# EAGLE design LED Cube PCB Board V.6 (EAGLE 8.6.0)
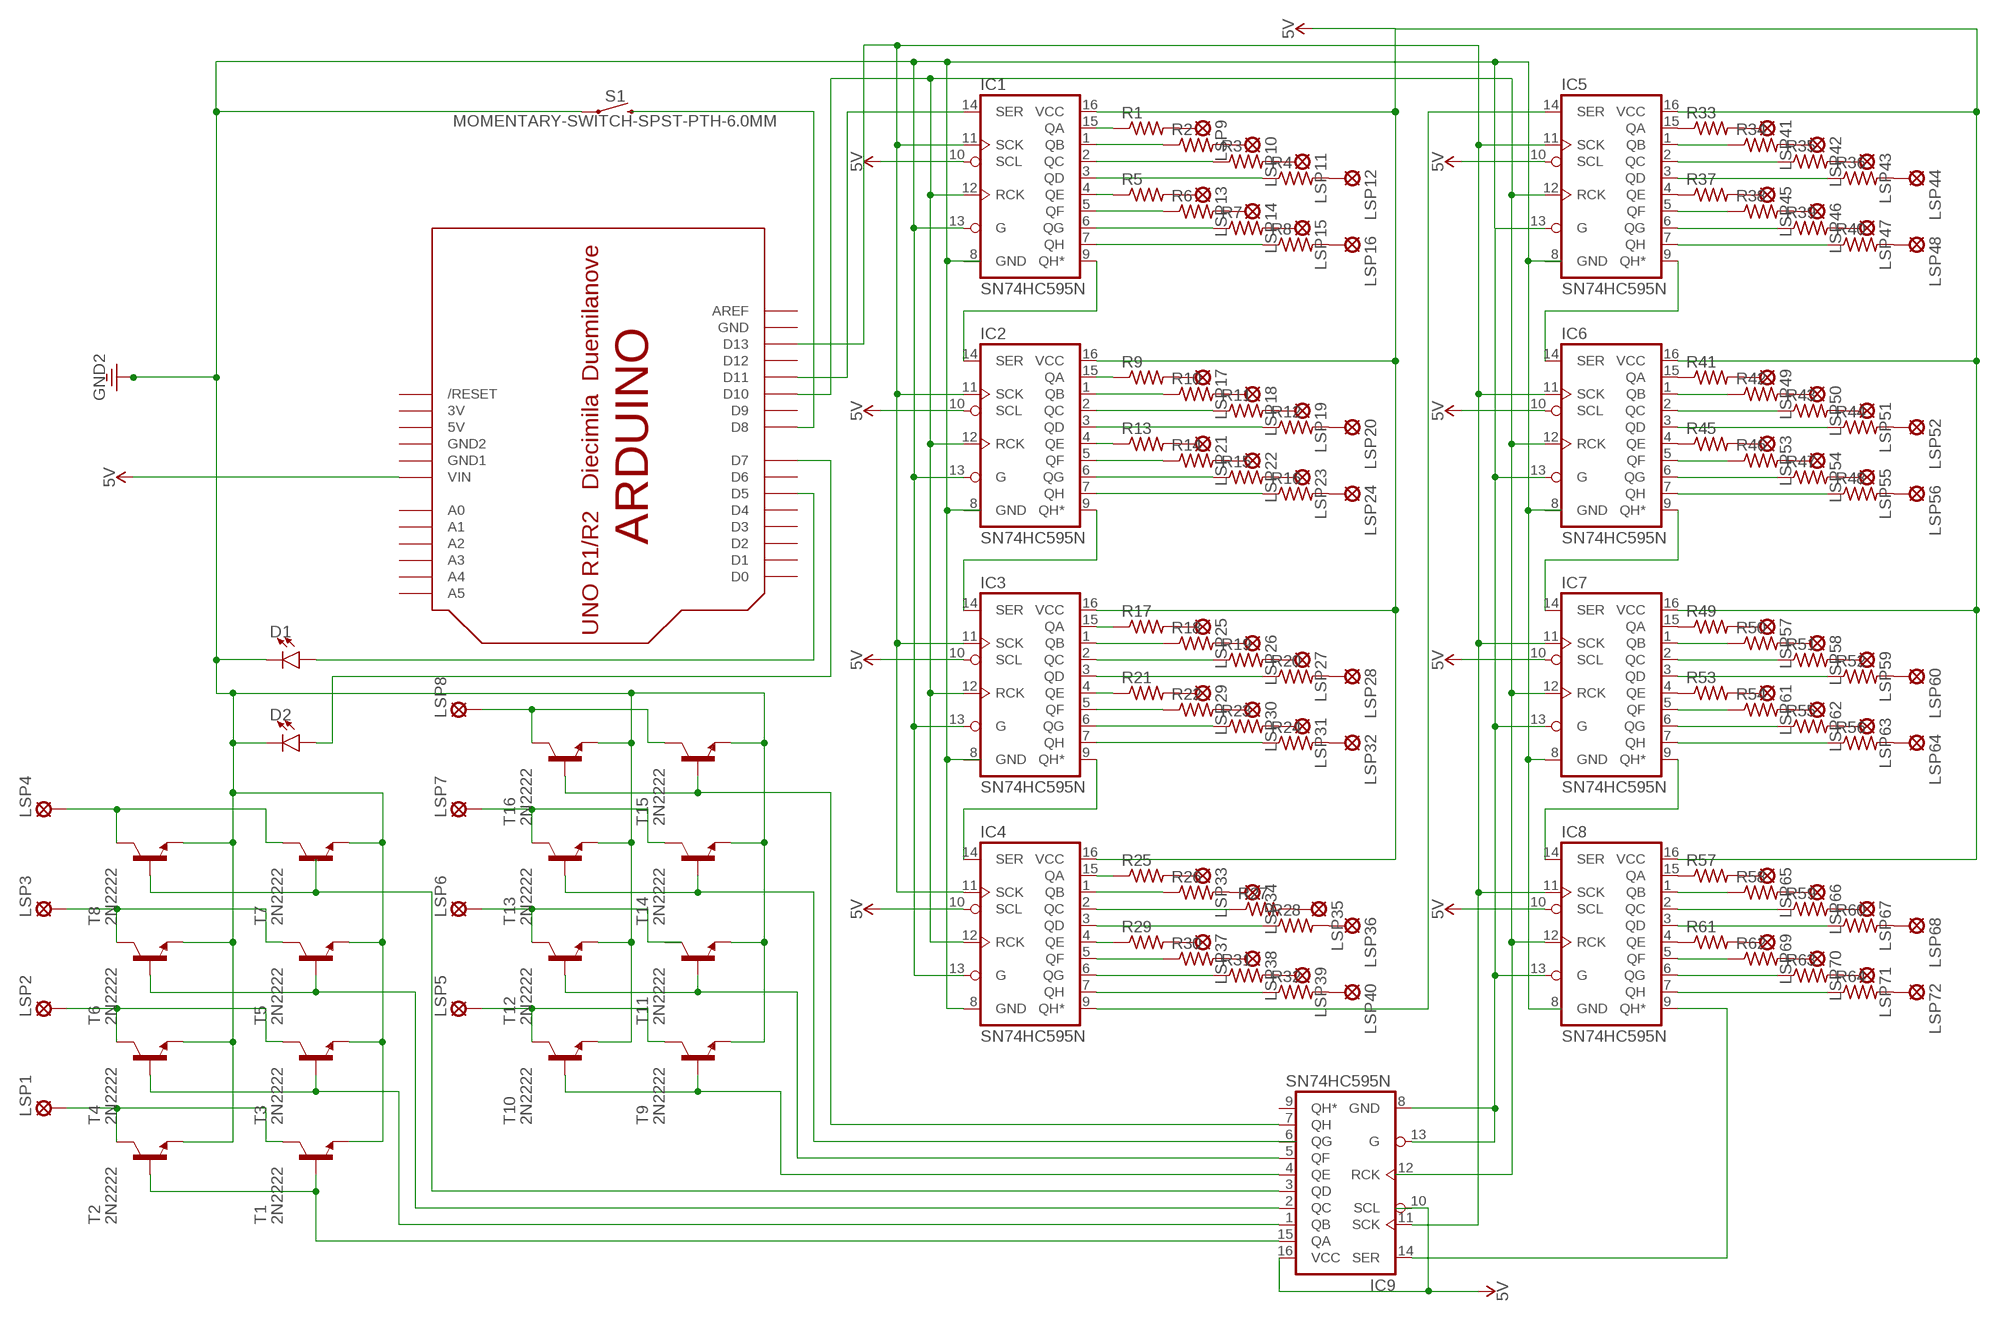
[diagram p0: schematic, sheet 1]

## Parts
D1  LED-3MM-NO_SILK  [LED_3MM-NS]
D2  LED-3MM-NO_SILK  [LED_3MM-NS]
IC1  SN74HC595N  74HC595N  [DIP16]
IC2  SN74HC595N  74HC595N  [DIP16]
IC3  SN74HC595N  74HC595N  [DIP16]
IC4  SN74HC595N  74HC595N  [DIP16]
IC5  SN74HC595N  74HC595N  [DIP16]
IC6  SN74HC595N  74HC595N  [DIP16]
IC7  SN74HC595N  74HC595N  [DIP16]
IC8  SN74HC595N  74HC595N  [DIP16]
IC9  SN74HC595N  74HC595N  [DIP16]
LSP1  LSP10  [LSP10]
LSP2  LSP10  [LSP10]
LSP3  LSP10  [LSP10]
LSP4  LSP10  [LSP10]
LSP5  LSP10  [LSP10]
LSP6  LSP10  [LSP10]
LSP7  LSP10  [LSP10]
LSP8  LSP10  [LSP10]
LSP9  LSP11  [LSP11]
LSP10  LSP11  [LSP11]
LSP11  LSP11  [LSP11]
LSP12  LSP11  [LSP11]
LSP13  LSP11  [LSP11]
LSP14  LSP11  [LSP11]
LSP15  LSP11  [LSP11]
LSP16  LSP11  [LSP11]
LSP17  LSP11  [LSP11]
LSP18  LSP11  [LSP11]
LSP19  LSP11  [LSP11]
LSP20  LSP11  [LSP11]
LSP21  LSP11  [LSP11]
LSP22  LSP11  [LSP11]
LSP23  LSP11  [LSP11]
LSP24  LSP11  [LSP11]
LSP25  LSP11  [LSP11]
LSP26  LSP11  [LSP11]
LSP27  LSP11  [LSP11]
LSP28  LSP11  [LSP11]
LSP29  LSP11  [LSP11]
LSP30  LSP11  [LSP11]
LSP31  LSP11  [LSP11]
LSP32  LSP11  [LSP11]
LSP33  LSP11  [LSP11]
LSP34  LSP11  [LSP11]
LSP35  LSP11  [LSP11]
LSP36  LSP11  [LSP11]
LSP37  LSP11  [LSP11]
LSP38  LSP11  [LSP11]
LSP39  LSP11  [LSP11]
LSP40  LSP11  [LSP11]
LSP41  LSP11  [LSP11]
LSP42  LSP11  [LSP11]
LSP43  LSP11  [LSP11]
LSP44  LSP11  [LSP11]
LSP45  LSP11  [LSP11]
LSP46  LSP11  [LSP11]
LSP47  LSP11  [LSP11]
LSP48  LSP11  [LSP11]
LSP49  LSP11  [LSP11]
LSP50  LSP11  [LSP11]
LSP51  LSP11  [LSP11]
LSP52  LSP11  [LSP11]
LSP53  LSP11  [LSP11]
LSP54  LSP11  [LSP11]
LSP55  LSP11  [LSP11]
LSP56  LSP11  [LSP11]
LSP57  LSP11  [LSP11]
LSP58  LSP11  [LSP11]
LSP59  LSP11  [LSP11]
LSP60  LSP11  [LSP11]
LSP61  LSP11  [LSP11]
LSP62  LSP11  [LSP11]
LSP63  LSP11  [LSP11]
LSP64  LSP11  [LSP11]
LSP65  LSP11  [LSP11]
LSP66  LSP11  [LSP11]
LSP67  LSP11  [LSP11]
LSP68  LSP11  [LSP11]
LSP69  LSP11  [LSP11]
LSP70  LSP11  [LSP11]
LSP71  LSP11  [LSP11]
LSP72  LSP11  [LSP11]
R1  R-US_0204/5  [0204/5]
R2  R-US_0204/5  [0204/5]
R3  R-US_0204/5  [0204/5]
R4  R-US_0204/5  [0204/5]
R5  R-US_0204/5  [0204/5]
R6  R-US_0204/5  [0204/5]
R7  R-US_0204/5  [0204/5]
R8  R-US_0204/5  [0204/5]
R9  R-US_0204/5  [0204/5]
R10  R-US_0204/5  [0204/5]
R11  R-US_0204/5  [0204/5]
R12  R-US_0204/5  [0204/5]
R13  R-US_0204/5  [0204/5]
R14  R-US_0204/5  [0204/5]
R15  R-US_0204/5  [0204/5]
R16  R-US_0204/5  [0204/5]
R17  R-US_0204/5  [0204/5]
R18  R-US_0204/5  [0204/5]
R19  R-US_0204/5  [0204/5]
R20  R-US_0204/5  [0204/5]
R21  R-US_0204/5  [0204/5]
R22  R-US_0204/5  [0204/5]
R23  R-US_0204/5  [0204/5]
R24  R-US_0204/5  [0204/5]
R25  R-US_0204/5  [0204/5]
R26  R-US_0204/5  [0204/5]
R27  R-US_0204/5  [0204/5]
R28  R-US_0204/5  [0204/5]
R29  R-US_0204/5  [0204/5]
R30  R-US_0204/5  [0204/5]
R31  R-US_0204/5  [0204/5]
R32  R-US_0204/5  [0204/5]
R33  R-US_0204/5  [0204/5]
R34  R-US_0204/5  [0204/5]
R35  R-US_0204/5  [0204/5]
R36  R-US_0204/5  [0204/5]
R37  R-US_0204/5  [0204/5]
R38  R-US_0204/5  [0204/5]
R39  R-US_0204/5  [0204/5]
R40  R-US_0204/5  [0204/5]
R41  R-US_0204/5  [0204/5]
R42  R-US_0204/5  [0204/5]
R43  R-US_0204/5  [0204/5]
R44  R-US_0204/5  [0204/5]
R45  R-US_0204/5  [0204/5]
R46  R-US_0204/5  [0204/5]
R47  R-US_0204/5  [0204/5]
R48  R-US_0204/5  [0204/5]
R49  R-US_0204/5  [0204/5]
R50  R-US_0204/5  [0204/5]
R51  R-US_0204/5  [0204/5]
R52  R-US_0204/5  [0204/5]
R53  R-US_0204/5  [0204/5]
R54  R-US_0204/5  [0204/5]
R55  R-US_0204/5  [0204/5]
R56  R-US_0204/5  [0204/5]
R57  R-US_0204/5  [0204/5]
R58  R-US_0204/5  [0204/5]
R59  R-US_0204/5  [0204/5]
R60  R-US_0204/5  [0204/5]
R61  R-US_0204/5  [0204/5]
R62  R-US_0204/5  [0204/5]
R63  R-US_0204/5  [0204/5]
R64  R-US_0204/5  [0204/5]
S1  MOMENTARY-SWITCH-SPST-PTH-6.0MM  [TACTILE_SWITCH_PTH_6.0MM]
T1  2N2222  [TO92-EBC-OVAL]
T2  2N2222  [TO92-EBC-OVAL]
T3  2N2222  [TO92-EBC-OVAL]
T4  2N2222  [TO92-EBC-OVAL]
T5  2N2222  [TO92-EBC-OVAL]
T6  2N2222  [TO92-EBC-OVAL]
T7  2N2222  [TO92-EBC-OVAL]
T8  2N2222  [TO92-EBC-OVAL]
T9  2N2222  [TO92-EBC-OVAL]
T10  2N2222  [TO92-EBC-OVAL]
T11  2N2222  [TO92-EBC-OVAL]
T12  2N2222  [TO92-EBC-OVAL]
T13  2N2222  [TO92-EBC-OVAL]
T14  2N2222  [TO92-EBC-OVAL]
T15  2N2222  [TO92-EBC-OVAL]
T16  2N2222  [TO92-EBC-OVAL]
U$1  ARDUINO-NOHOLE  [ARDUINO-NOHOLE]

## Nets
5V: IC1.10(SCL) IC1.16(VCC) IC2.16(VCC) IC3.16(VCC) IC4.16(VCC) IC5.10(SCL) IC5.16(VCC) IC6.10(SCL) IC6.16(VCC) IC7.10(SCL) IC7.16(VCC) IC8.10(SCL) IC8.16(VCC) IC9.10(SCL) IC9.16(VCC) U$1.VIN
GND: D1.K(C) D2.K(C) IC1.13(G) IC2.13(G) IC3.13(G) IC4.8(GND) IC4.13(G) IC5.8(GND) IC5.13(G) IC6.8(GND) IC6.13(G) IC7.8(GND) IC7.13(G) IC8.8(GND) IC8.13(G) IC9.8(GND) IC9.13(G) S1.1 T1.E T2.E T3.E T4.E T5.E T6.E T7.E T8.E T9.E T10.E T11.E T12.E T13.E T14.E T15.E T16.E ; supply symbol labelled GND2
N$1: IC1.7(QH) R8.1
N$2: IC1.6(QG) R7.1
N$3: IC1.5(QF) R6.1
N$4: IC1.4(QE) R5.1
N$5: IC1.3(QD) R4.1
N$6: IC1.2(QC) R3.1
N$7: IC1.1(QB) R2.1
N$8: IC1.15(QA) R1.1
N$9: LSP9.MP R1.2
N$10: LSP10.MP R2.2
N$11: LSP11.MP R3.2
N$12: LSP12.MP R4.2
N$13: LSP13.MP R5.2
N$14: LSP14.MP R6.2
N$15: LSP15.MP R7.2
N$16: LSP16.MP R8.2
N$17: IC6.1(QB) R42.1
N$18: IC6.2(QC) R43.1
N$19: IC6.3(QD) R44.1
N$20: IC6.5(QF) R46.1
N$21: IC6.6(QG) R47.1
N$22: IC6.7(QH) R48.1
N$23: IC8.1(QB) R58.1
N$24: IC8.2(QC) R59.1
N$25: IC8.3(QD) R60.1
N$26: IC8.5(QF) R62.1
N$27: IC8.6(QG) R63.1
N$28: IC8.7(QH) R64.1
N$29: IC9.7(QH) T15.B T16.B
N$30: T13.B T14.B
N$31: IC9.5(QF) T11.B T12.B
N$32: IC9.4(QE) T9.B T10.B
N$33: IC2.7(QH) R16.1
N$34: IC2.6(QG) R15.1
N$35: IC2.5(QF) R14.1
N$36: IC2.4(QE) R13.1
N$37: IC2.3(QD) R12.1
N$38: IC2.2(QC) R11.1
N$39: IC2.1(QB) R10.1
N$40: IC2.15(QA) R9.1
N$41: IC5.15(QA) R33.1
N$42: IC5.4(QE) R37.1
N$43: IC6.15(QA) R41.1
N$44: IC6.4(QE) R45.1
N$45: IC8.15(QA) R57.1
N$46: IC8.4(QE) R61.1
N$47: IC7.4(QE) R53.1
N$48: IC7.15(QA) R49.1
N$49: IC4.1(QB) R26.1
N$50: IC4.15(QA) R25.1
N$51: LSP17.MP R9.2
N$52: IC4.2(QC) R27.1
N$53: LSP18.MP R10.2
N$54: IC4.3(QD) R28.1
N$55: IC4.4(QE) R29.1
N$56: IC4.5(QF) R30.1
N$57: IC3.1(QB) R18.1
N$58: IC4.6(QG) R31.1
N$59: IC4.7(QH) R32.1
N$60: LSP19.MP R11.2
N$61: LSP20.MP R12.2
N$62: LSP21.MP R13.2
N$63: LSP22.MP R14.2
N$64: LSP23.MP R15.2
N$65: IC3.7(QH) R24.1
N$66: IC3.6(QG) R23.1
N$67: IC3.5(QF) R22.1
N$68: IC3.4(QE) R21.1
N$69: IC3.3(QD) R20.1
N$70: IC3.2(QC) R19.1
N$71: LSP24.MP R16.2
N$72: IC3.15(QA) R17.1
N$73: LSP25.MP R17.2
N$74: LSP26.MP R18.2
N$75: LSP27.MP R19.2
N$76: LSP28.MP R20.2
N$77: LSP29.MP R21.2
N$78: LSP30.MP R22.2
N$79: LSP31.MP R23.2
N$80: LSP32.MP R24.2
N$81: IC5.7(QH) R40.1
N$82: IC5.6(QG) R39.1
N$83: IC5.5(QF) R38.1
N$84: LSP33.MP R25.2
N$85: IC5.3(QD) R36.1
N$86: IC5.2(QC) R35.1
N$87: IC5.1(QB) R34.1
N$88: LSP34.MP R26.2
N$89: LSP35.MP R27.2
N$90: LSP36.MP R28.2
N$91: LSP37.MP R29.2
N$92: LSP38.MP R30.2
N$93: LSP39.MP R31.2
N$94: LSP40.MP R32.2
N$95: LSP41.MP R33.2
N$96: LSP42.MP R34.2
N$97: LSP43.MP R35.2
N$98: LSP44.MP R36.2
N$99: LSP45.MP R37.2
N$100: LSP46.MP R38.2
N$101: LSP47.MP R39.2
N$102: LSP48.MP R40.2
N$103: LSP49.MP R41.2
N$104: LSP50.MP R42.2
N$105: LSP51.MP R43.2
N$106: LSP52.MP R44.2
N$107: LSP53.MP R45.2
N$108: LSP54.MP R46.2
N$109: LSP55.MP R47.2
N$110: LSP56.MP R48.2
N$111: LSP57.MP R49.2
N$112: LSP58.MP R50.2
N$113: IC7.7(QH) R56.1
N$114: IC7.6(QG) R55.1
N$115: IC7.5(QF) R54.1
N$116: LSP59.MP R51.2
N$117: IC7.3(QD) R52.1
N$118: IC7.2(QC) R51.1
N$119: IC7.1(QB) R50.1
N$120: LSP60.MP R52.2
N$121: LSP61.MP R53.2
N$122: LSP62.MP R54.2
N$123: LSP63.MP R55.2
N$124: LSP64.MP R56.2
N$125: LSP65.MP R57.2
N$126: LSP66.MP R58.2
N$127: LSP67.MP R59.2
N$128: LSP68.MP R60.2
N$129: IC1.9(QH*) IC2.14(SER)
N$130: IC5.9(QH*) IC6.14(SER)
N$131: IC6.9(QH*) IC7.14(SER)
N$132: IC2.9(QH*) IC3.14(SER)
N$133: IC3.9(QH*) IC4.14(SER)
N$134: IC7.9(QH*) IC8.14(SER)
N$135: S1.3 U$1.D8
N$136: IC1.12(RCK) IC2.12(RCK) IC3.12(RCK) IC4.12(RCK) IC5.12(RCK) IC6.12(RCK) IC7.12(RCK) IC8.12(RCK) U$1.D10
N$137: IC1.14(SER) U$1.D11
N$138: IC1.11(SCK) IC2.11(SCK) IC3.11(SCK) IC4.11(SCK) IC5.11(SCK) IC6.11(SCK) IC7.11(SCK) IC8.11(SCK) IC9.11(SCK) U$1.D13
N$139: IC8.9(QH*) IC9.14(SER)
N$140: D1.A U$1.D5
N$141: IC9.1(QB) T3.B T4.B
N$142: IC4.9(QH*) IC5.14(SER)
N$143: IC9.2(QC) T5.B T6.B
N$144: IC9.3(QD) T8.B
N$145: LSP69.MP R61.2
N$146: LSP70.MP R62.2
N$147: LSP71.MP R63.2
N$148: IC9.15(QA) T1.B T2.B
N$149: LSP72.MP R64.2
N$150: D2.A U$1.D7
N$151: LSP3.MP T5.C T6.C
N$152: LSP4.MP T7.C T8.C
N$153: LSP2.MP T3.C T4.C
N$154: LSP1.MP T1.C T2.C
N$155: LSP8.MP T15.C T16.C
N$156: LSP7.MP T13.C T14.C
N$157: LSP6.MP T12.C
N$158: LSP5.MP T9.C T10.C
Unconnected: IC2.10(SCL) IC3.10(SCL) IC4.10(SCL) IC9.6(QG) IC9.9(QH*) IC9.12(RCK) T7.B T11.C U$1.A0 U$1.A1 U$1.A2 U$1.A3 U$1.A4 U$1.A5 U$1.AREF U$1.D0 U$1.D1 U$1.D2 U$1.D3 U$1.D4 U$1.D6 U$1.D9 U$1.D12 U$1.RESET(/RESET)

## Power pins joined to a net without a drawn wire
3V: U$1.3V
5V: U$1.5V
GND: IC1.8(GND) IC2.8(GND) IC3.8(GND) U$1.GND
GND1: U$1.GND1
GND2: U$1.GND2

## Library data of the parts
D1 D2 = SparkFun-LED:LED: LED (Generic) Standard schematic elements and footprints for 5mm, 3mm, 1206, and 0603 sized LEDs. Generic LEDs with no color specified.
IC1-IC9 = SparkFun-IC-Logic:74*595: 8-Bit Shift Register (Serial to Parallel) Datasheet <http://cdn.sparkfun.com/datasheets/BreakoutBoards/MM74HC595.pdf> SparkFun Products SparkFun Shift Register Breakout - 74HC595 <https://www.sparkfun.com/products/10680> (BOB-10680); PROD_ID: IC-13123
LSP1-LSP8 = solpad:LSP10: SOLDER PAD drill 1.0 mm, distributor Buerklin, 12H555
LSP9-LSP72 = solpad:LSP11: SOLDER PAD drill 1.1 mm
R1-R64 = adafruit:R-US_: RESISTOR, American symbol
S1 = SparkFun-Switches:MOMENTARY-SWITCH-SPST: Momentary Switch (Pushbutton) - SPST Normally-open (NO) SPST momentary switches (buttons, pushbuttons). Variants PTH-12MM - 12mm square, through-hole Momentary Pushbutton Switch - 12mm Square <https://www.sparkfun.com/products/9190> (COM-09190) PTH-6.0MM, PTH-6.0MM-KIT - 6.0mm square, through-hole Mini Pushbutton Switch <https://www.sparkfun.com/products/97> (COM-00097) KIT package intended for soldering kit's - only one side of pads' copper is exposed. PTH-RIGHT-ANGLE-KIT - Right-angle, through-hole Right Angle Tactile Button <https://www.sparkfun.com/products/10791> - Used on SparkFun BigTime Watch Kit <https://www.sparkfun.com/products/11734> SMD-12MM - 12mm square, surface-mount Tactile Button - SMD (12mm) <https://www.sparkfun.com/products/12993> (COM-12993) Used on SparkFun PicoBoard <https://www.sparkfun.com/products/11888> SMD-4.5MM - 4.5mm Square Trackball Switch Used on SparkFun Blackberry Trackballer Breakout <https://www.sparkfun.com/products/13169> SMD-4.6MMX2.8MM - 4.60mm x 2.80mm, surface mount Used on SparkFun SAMD21 Mini Breakout <https://www.sparkfun.com/products/13664> SMD-5.2MM, SMD-5.2-REDUNDANT - 5.2mm square, surface-mount Mini Pushbutton Switch - SMD <https://www.sparkfun.com/products/8720> (COM-08720) Used on Arduino Pro Mini <https://www.sparkfun.com/products/11114> REDUNDANT package connects both switch circuits together SMD-6.0X3.5MM - 6.0 x 3.5mm, surface mount Momentary Reset Switch SMD <https://www.sparkfun.com/products/8229> (COM-08229) SMD-6.2MM-TALL - 6.2mm square, surface mount Tactile Button - SMD (6mm) <https://www.sparkfun.com/products/12992> Used on SparkFun Digital Sandbox <https://www.sparkfun.com/products/12651> SMD-RIGHT-ANGLE - Right-angle, surface mount Used on SparkFun Block for Intel® Edison - Arduino <https://www.sparkfun.com/products/13036>; PROD_ID: SWCH-08441; SF_SKU: COM-00097
T1-T16 = adafruit:2N2222: NPN TRANSISTOR Big oval pads
U$1 = adafruit:ARDUINO: Arduino Diecimila/Duemilanove Make a shield with ease, this package has all the named pins as well as the two mounting drill holes and an outline of the USB and DC power connector. The outline is on the DIMENSION layer, so if your board house uses it they will cut the outline to match. http://www.ladyada.net/library/pcb/eaglelibrary.html

## Net classes
0 default: width 0.305 mm, drill 0.508 mm, clearance 0.203 mm

## Board
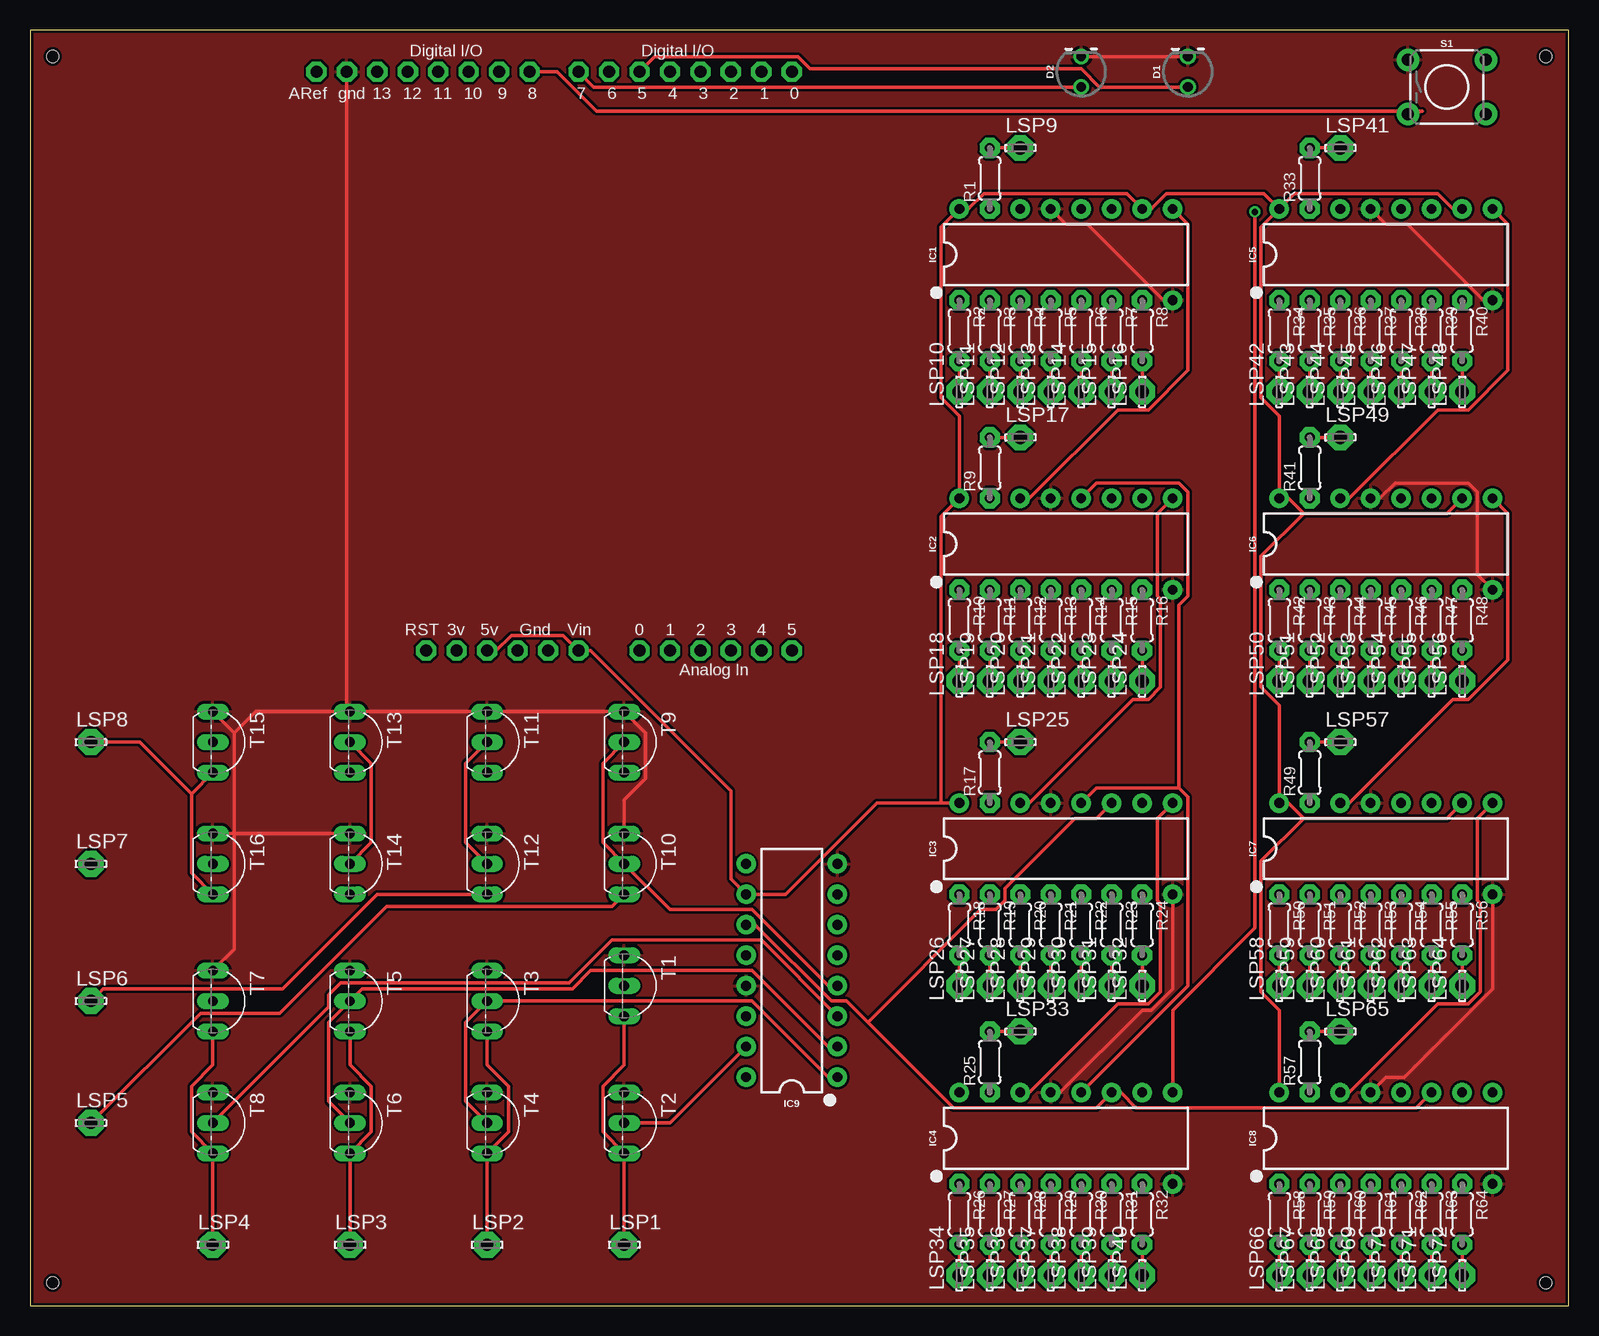
[diagram p1: board, top side]
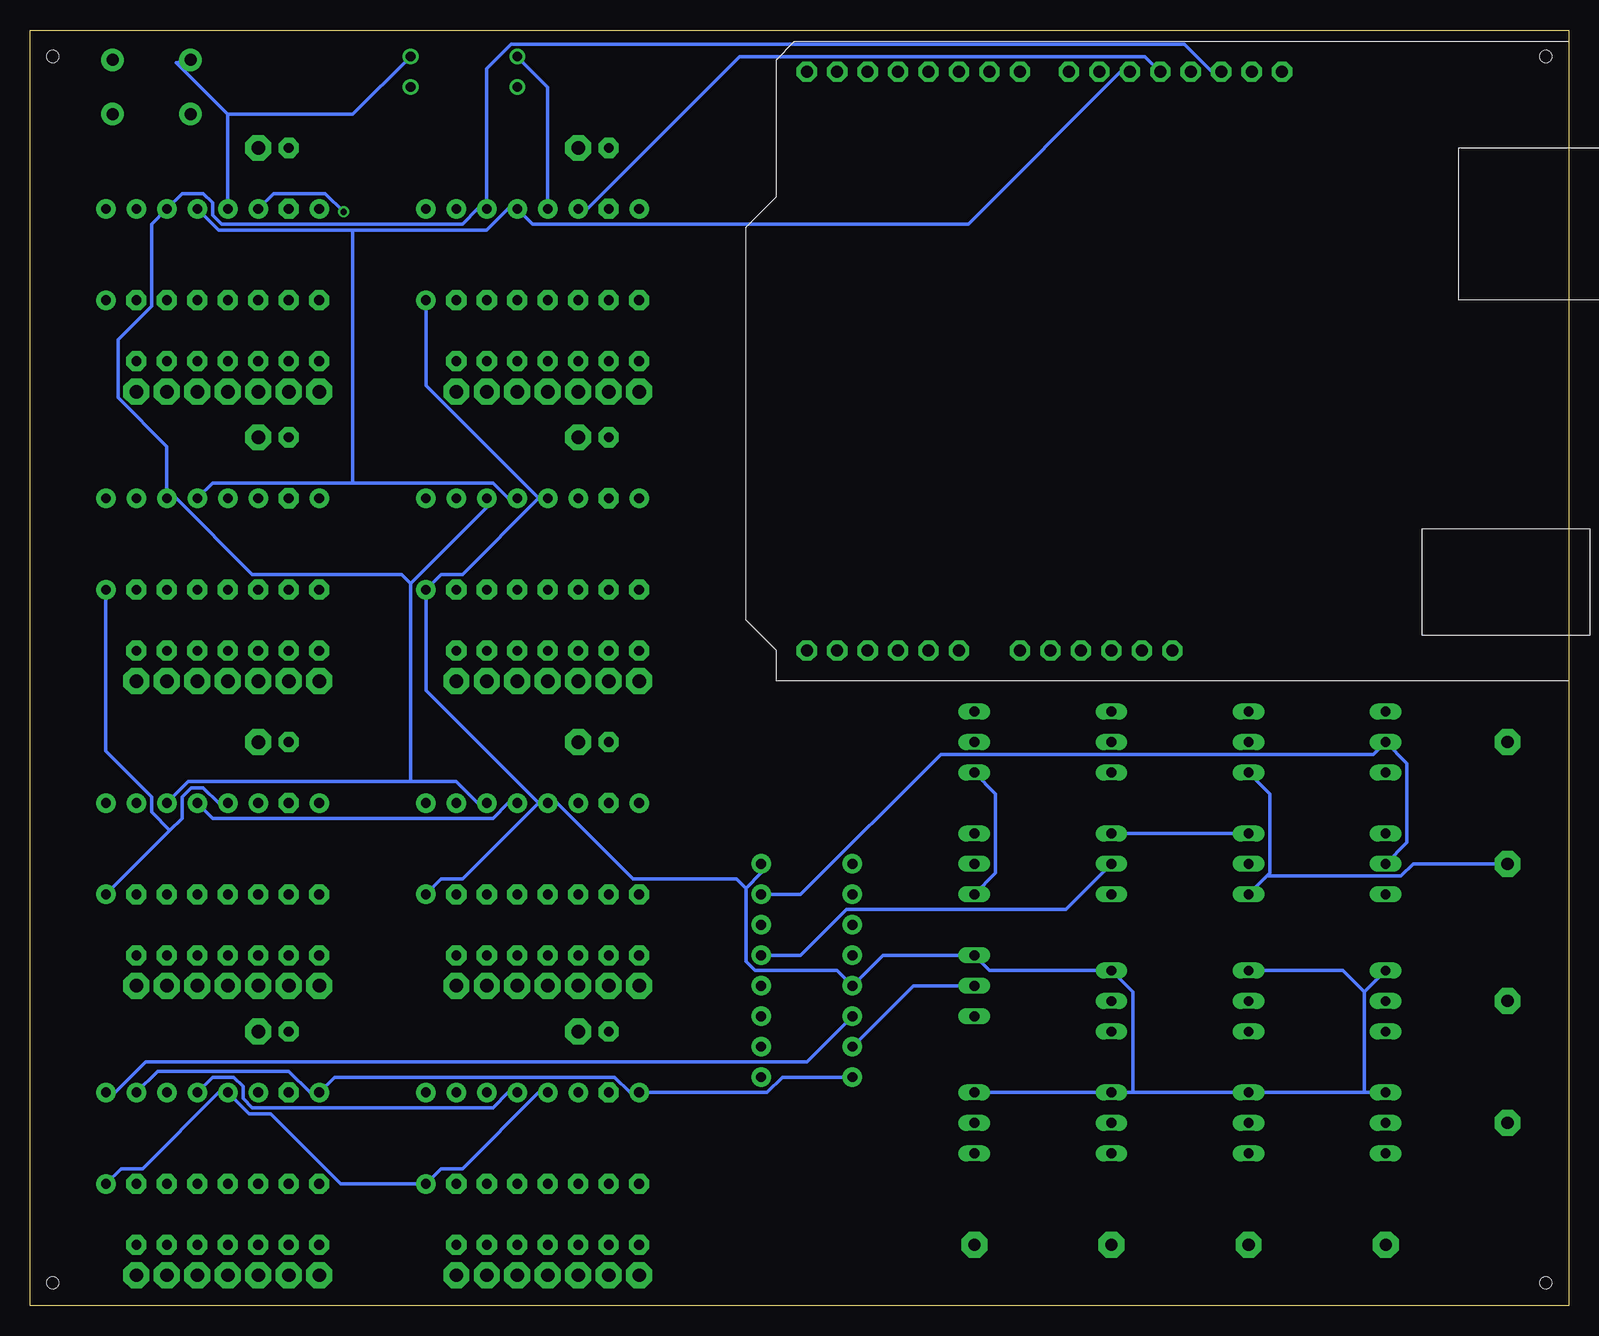
[diagram p2: board, bottom side, seen from below]

Size 128.25 x 106.35 mm. Coordinates in mm from the lower left corner, seen from the top.
Outline: 0,0 128.25,0 128.25,106.35 0,106.35 0,0
Copper layers (1*16): Top 0.035mm / dielectric 1.5mm / Bottom 0.035mm
Design rules "default *": minimum track width 3mil, minimum drill 0.35mm, track to track 6mil, track to pad 6mil, pad to pad 6mil, via to via 6mil, smd to smd 6mil, copper to edge 10mil, drill to drill 2mil, minimum pad ring 10mil, minimum via ring 8mil, stop-mask expansion 4mil, vias tented up to drill 0mil, thermal gap 10mil
Holes 1 mm at 1.91,1.91 1.91,104.14 126.36,104.14 126.36,1.91

### Footprints (pad centres in the part's own frame; a part is rotated, then mirrored left to right if it is on the bottom)
LED_3MM-NS = drill 0.813: A -1.27,0; K 1.27,0
DIP16 = drill 0.813 pad 1.626: 1 -8.89,-3.81; 2 -6.35,-3.81; 3 -3.81,-3.81; 4 -1.27,-3.81; 5 1.27,-3.81; 6 3.81,-3.81; 7 6.35,-3.81; 8 8.89,-3.81; 9 8.89,3.81; 10 6.35,3.81; 11 3.81,3.81; 12 1.27,3.81; 13 -1.27,3.81; 14 -3.81,3.81; 15 -6.35,3.81; 16 -8.89,3.81
LSP10 = drill 1.016 pad 2.159 octagon: MP 0,0
LSP11 = drill 1.118 pad 2.159 octagon: MP 0,0
0204/5 = drill 0.813 pad 1.676 octagon: 1 -2.54,0; 2 2.54,0
TACTILE_SWITCH_PTH_6.0MM = drill 1.016 pad 1.88: 1 -3.251,2.261; 2 3.251,2.261; 3 -3.251,-2.261; 4 3.251,-2.261
TO92-EBC-OVAL = drill 0.813 long: B 0,-1.27; C 2.54,-1.27; E -2.54,-1.27
ARDUINO-NOHOLE = drill 1 pad 1.676 octagon: 3V 35.56,2.54; 5V 38.1,2.54; A0 50.8,2.54; A1 53.34,2.54; A2 55.88,2.54; A3 58.42,2.54; A4 60.96,2.54; A5 63.5,2.54; AREF 23.876,50.8; D0 63.5,50.8; D1 60.96,50.8; D2 58.42,50.8; D3 55.88,50.8; D4 53.34,50.8; D5 50.8,50.8; D6 48.26,50.8; D7 45.72,50.8; D8 41.656,50.8; D9 39.116,50.8; D10 36.576,50.8; D11 34.036,50.8; D12 31.496,50.8; D13 28.956,50.8; GND 26.416,50.8; GND1 43.18,2.54; GND2 40.64,2.54; RESET 33.02,2.54; VIN 45.72,2.54

### Placement (x,y rotation side)
D1  96.52,102.87 90 top
D2  87.63,102.87 90 top
IC1  86.36,87.63 0 top
IC2  86.36,63.5 0 top
IC3  86.36,38.1 0 top
IC4  86.36,13.97 0 top
IC5  113.03,87.63 0 top
IC6  113.03,63.5 0 top
IC7  113.03,38.1 0 top
IC8  113.03,13.97 0 top
IC9  63.5,27.94 90 top
LSP1  49.53,5.08 0 top
LSP2  38.1,5.08 0 top
LSP3  26.67,5.08 0 top
LSP4  15.24,5.08 0 top
LSP5  5.08,15.24 0 top
LSP6  5.08,25.4 0 top
LSP7  5.08,36.83 0 top
LSP8  5.08,46.99 0 top
LSP9  82.55,96.52 0 top
LSP10  77.47,76.2 90 top
LSP11  80.01,76.2 90 top
LSP12  82.55,76.2 90 top
LSP13  85.09,76.2 90 top
LSP14  87.63,76.2 90 top
LSP15  90.17,76.2 90 top
LSP16  92.71,76.2 90 top
LSP17  82.55,72.39 0 top
LSP18  77.47,52.07 90 top
LSP19  80.01,52.07 90 top
LSP20  82.55,52.07 90 top
LSP21  85.09,52.07 90 top
LSP22  87.63,52.07 90 top
LSP23  90.17,52.07 90 top
LSP24  92.71,52.07 90 top
LSP25  82.55,46.99 0 top
LSP26  77.47,26.67 90 top
LSP27  80.01,26.67 90 top
LSP28  82.55,26.67 90 top
LSP29  85.09,26.67 90 top
LSP30  87.63,26.67 90 top
LSP31  90.17,26.67 90 top
LSP32  92.71,26.67 90 top
LSP33  82.55,22.86 0 top
LSP34  77.47,2.54 90 top
LSP35  80.01,2.54 90 top
LSP36  82.55,2.54 90 top
LSP37  85.09,2.54 90 top
LSP38  87.63,2.54 90 top
LSP39  90.17,2.54 90 top
LSP40  92.71,2.54 90 top
LSP41  109.22,96.52 0 top
LSP42  104.14,76.2 90 top
LSP43  106.68,76.2 90 top
LSP44  109.22,76.2 90 top
LSP45  111.76,76.2 90 top
LSP46  114.3,76.2 90 top
LSP47  116.84,76.2 90 top
LSP48  119.38,76.2 90 top
LSP49  109.22,72.39 0 top
LSP50  104.14,52.07 90 top
LSP51  106.68,52.07 90 top
LSP52  109.22,52.07 90 top
LSP53  111.76,52.07 90 top
LSP54  114.3,52.07 90 top
LSP55  116.84,52.07 90 top
LSP56  119.38,52.07 90 top
LSP57  109.22,46.99 0 top
LSP58  104.14,26.67 90 top
LSP59  106.68,26.67 90 top
LSP60  109.22,26.67 90 top
LSP61  111.76,26.67 90 top
LSP62  114.3,26.67 90 top
LSP63  116.84,26.67 90 top
LSP64  119.38,26.67 90 top
LSP65  109.22,22.86 0 top
LSP66  104.14,2.54 90 top
LSP67  106.68,2.54 90 top
LSP68  109.22,2.54 90 top
LSP69  111.76,2.54 90 top
LSP70  114.3,2.54 90 top
LSP71  116.84,2.54 90 top
LSP72  119.38,2.54 90 top
R1  80.01,93.98 90 top
R2  77.47,81.28 270 top
R3  80.01,81.28 270 top
R4  82.55,81.28 270 top
R5  85.09,81.28 270 top
R6  87.63,81.28 270 top
R7  90.17,81.28 270 top
R8  92.71,81.28 270 top
R9  80.01,69.85 90 top
R10  77.47,57.15 270 top
R11  80.01,57.15 270 top
R12  82.55,57.15 270 top
R13  85.09,57.15 270 top
R14  87.63,57.15 270 top
R15  90.17,57.15 270 top
R16  92.71,57.15 270 top
R17  80.01,44.45 90 top
R18  77.47,31.75 270 top
R19  80.01,31.75 270 top
R20  82.55,31.75 270 top
R21  85.09,31.75 270 top
R22  87.63,31.75 270 top
R23  90.17,31.75 270 top
R24  92.71,31.75 270 top
R25  80.01,20.32 90 top
R26  77.47,7.62 270 top
R27  80.01,7.62 270 top
R28  82.55,7.62 270 top
R29  85.09,7.62 270 top
R30  87.63,7.62 270 top
R31  90.17,7.62 270 top
R32  92.71,7.62 270 top
R33  106.68,93.98 90 top
R34  104.14,81.28 270 top
R35  106.68,81.28 270 top
R36  109.22,81.28 270 top
R37  111.76,81.28 270 top
R38  114.3,81.28 270 top
R39  116.84,81.28 270 top
R40  119.38,81.28 270 top
R41  106.68,69.85 90 top
R42  104.14,57.15 270 top
R43  106.68,57.15 270 top
R44  109.22,57.15 270 top
R45  111.76,57.15 270 top
R46  114.3,57.15 270 top
R47  116.84,57.15 270 top
R48  119.38,57.15 270 top
R49  106.68,44.45 90 top
R50  104.14,31.75 270 top
R51  106.68,31.75 270 top
R52  109.22,31.75 270 top
R53  111.76,31.75 270 top
R54  114.3,31.75 270 top
R55  116.84,31.75 270 top
R56  119.38,31.75 270 top
R57  106.68,20.32 90 top
R58  104.14,7.62 270 top
R59  106.68,7.62 270 top
R60  109.22,7.62 270 top
R61  111.76,7.62 270 top
R62  114.3,7.62 270 top
R63  116.84,7.62 270 top
R64  119.38,7.62 270 top
S1  118.11,101.6 0 top
T1  50.8,26.67 270 top
T2  50.8,15.24 270 top
T3  39.37,25.4 270 top
T4  39.37,15.24 270 top
T5  27.94,25.4 270 top
T6  27.94,15.24 270 top
T7  16.51,25.4 270 top
T8  16.51,15.24 270 top
T9  50.8,46.99 270 top
T10  50.8,36.83 270 top
T11  39.37,46.99 270 top
T12  39.37,36.83 270 top
T13  27.94,46.99 270 top
T14  27.94,36.83 270 top
T15  16.51,46.99 270 top
T16  16.51,36.83 270 top
U$1  0,52.07 0 top

### Tracks (layer width: path | path; a pad name or v marks a point on that pad's centre or on a via)
5V
  Top 0.305: 106.17,40.64 104.9,41.91 IC7.16 104.14,50.04 102.62,51.56 102.62,62.48 106.17,66.04 | 106.17,40.64 118.11,40.64 IC7.10 | IC8.16 104.14,24.64 102.62,26.16 102.62,37.08 106.17,40.64 | U$1.5V 38.86,54.61 40.13,55.88 44.45,55.88 U$1.VIN 46.74,54.61 58.42,42.93 58.42,35.56 IC9.10 62.99,34.29 70.61,41.91 75.95,41.91 | IC3.16 75.95,41.91 | 106.17,66.04 104.9,67.31 IC6.16 104.14,74.17 102.62,75.69 102.62,89.92 IC5.16 | 106.17,66.04 118.11,66.04 IC6.10 | IC5.16 102.87,92.71 94.74,92.71 93.47,91.44 IC1.10 91.44,92.71 79.5,92.71 78.23,91.44 IC1.16 75.95,89.92 75.95,75.69 77.47,74.17 IC2.16 75.95,65.79 75.95,41.91 | IC5.10 118.62,91.44 117.35,92.71 105.41,92.71 IC5.16
  Bottom 0.305: IC9.16 65.53,19.05 66.8,17.78 IC4.16 78.23,17.78 79.5,19.05 102.87,19.05 IC8.16 104.9,17.78 106.68,19.56 117.6,19.56 IC8.10
GND
  Top 0.305: T10.E 49.53,42.16 51.31,43.94 51.31,47.75 T9.E T11.E T13.E 26.42,49.53 | T14.E 17.02,39.37 | 17.02,39.37 T16.E | 17.02,47.75 T15.E | 17.02,39.37 17.02,47.75 | 26.42,49.53 18.8,49.53 17.02,47.75 | 26.42,49.53 U$1.GND | IC6.13 112.52,67.31 113.79,68.58 119.89,68.58 120.65,67.82 120.65,60.96 IC6.8 | IC7.8 121.92,26.42 114.55,19.05 113.03,19.05 IC8.13 | IC5.8 121.16,83.82 114.81,90.17 113.03,90.17 IC5.13 | D1.K D2.K | IC1.8 94.49,83.82 88.14,90.17 86.36,90.17 IC1.13 | IC4.13 85.85,17.78 92.71,24.64 93.47,24.64 95.25,26.42 IC3.8 | 17.02,39.37 17.02,29.72 T7.E
  Bottom 0.305: T14.E T12.E | IC7.13 112.52,41.91 113.79,43.18 114.81,43.18 115.57,42.42 115.57,40.64 116.59,39.62 | IC7.8 116.59,39.62 | IC4.13 85.85,17.78 92.2,11.43 93.98,11.43 IC4.8 102.36,10.16 108.2,16 109.98,16 IC8.13 112.52,17.78 118.87,11.43 120.65,11.43 IC8.8 | IC6.8 121.92,46.23 118.11,42.42 118.11,41.15 116.59,39.62 | 111.76,99.31 IC5.13 | 111.76,99.31 116.08,103.63 S1.1 | 85.85,67.31 92.2,60.96 93.98,60.96 IC2.8 95.25,51.31 85.85,41.91 | IC1.13 85.09,101.6 D2.K | 85.85,67.31 95.25,76.71 IC1.8 | 85.85,67.31 IC2.13 | 111.76,99.31 101.35,99.31 D1.K | 17.02,17.78 T6.E 36.32,17.78 | 17.02,17.78 T8.E | 17.02,26.16 T7.E | 17.02,17.78 17.02,26.16 | T5.E 18.8,27.94 17.02,26.16 | 36.32,17.78 T4.E T2.E | 36.32,17.78 36.32,26.16 T3.E 48.26,27.94 T1.E 57.15,29.21 IC9.13 60.96,27.94 67.82,27.94 68.58,28.7 68.58,34.8 | 85.85,41.91 92.2,35.56 93.98,35.56 IC3.8 | IC9.8 67.31,36.07 68.58,34.8 | 68.58,34.8 69.34,35.56 77.98,35.56 84.33,41.91 IC3.13 85.85,41.91
  pour Top: -1.27,0 129.54,0 129.54,107.95 -1.27,107.95
N$9
  Top 0.305: LSP9.MP R1.2
N$10
  Top 0.305: LSP10.MP R2.2
N$11
  Top 0.305: LSP11.MP R3.2
N$12
  Top 0.305: LSP12.MP R4.2
N$13
  Top 0.305: LSP13.MP R5.2
N$14
  Top 0.305: LSP14.MP R6.2
N$15
  Top 0.305: LSP15.MP R7.2
N$16
  Top 0.305: LSP16.MP R8.2
N$29
  Bottom 0.305: T16.B 13.46,38.61 13.46,45.21 T15.B 16.26,45.97 52.32,45.97 64.01,34.29 IC9.7
N$30
  Top 0.305: T14.B 28.45,38.61 28.45,45.21 T13.B
N$31
  Top 0.305: T12.B 36.32,38.61 36.32,45.21 T11.B
  Bottom 0.305: IC9.5 64.01,29.21 60.2,33.02 41.91,33.02 T12.B
N$32
  Top 0.305: T9.B 47.75,45.21 47.75,38.61 T10.B 53.34,33.02 60.2,33.02 66.55,26.67 IC9.4
N$51
  Top 0.305: LSP17.MP R9.2
N$53
  Top 0.305: LSP18.MP R10.2
N$60
  Top 0.305: LSP19.MP R11.2
N$61
  Top 0.305: LSP20.MP R12.2
N$62
  Top 0.305: LSP21.MP R13.2
N$63
  Top 0.305: LSP22.MP R14.2
N$64
  Top 0.305: LSP23.MP R15.2
N$71
  Top 0.305: LSP24.MP R16.2
N$73
  Top 0.305: LSP25.MP R17.2
N$74
  Top 0.305: LSP26.MP R18.2
N$75
  Top 0.305: LSP27.MP R19.2
N$76
  Top 0.305: LSP28.MP R20.2
N$77
  Top 0.305: LSP29.MP R21.2
N$78
  Top 0.305: LSP30.MP R22.2
N$79
  Top 0.305: LSP31.MP R23.2
N$80
  Top 0.305: LSP32.MP R24.2
N$84
  Top 0.305: LSP33.MP R25.2
N$88
  Top 0.305: LSP34.MP R26.2
N$89
  Top 0.305: LSP35.MP R27.2
N$90
  Top 0.305: LSP36.MP R28.2
N$91
  Top 0.305: LSP37.MP R29.2
N$92
  Top 0.305: LSP38.MP R30.2
N$93
  Top 0.305: LSP39.MP R31.2
N$94
  Top 0.305: LSP40.MP R32.2
N$95
  Top 0.305: LSP41.MP R33.2
N$96
  Top 0.305: LSP42.MP R34.2
N$97
  Top 0.305: LSP43.MP R35.2
N$98
  Top 0.305: LSP44.MP R36.2
N$99
  Top 0.305: LSP45.MP R37.2
N$100
  Top 0.305: LSP46.MP R38.2
N$101
  Top 0.305: LSP47.MP R39.2
N$102
  Top 0.305: LSP48.MP R40.2
N$103
  Top 0.305: LSP49.MP R41.2
N$104
  Top 0.305: LSP50.MP R42.2
N$105
  Top 0.305: LSP51.MP R43.2
N$106
  Top 0.305: LSP52.MP R44.2
N$107
  Top 0.305: LSP53.MP R45.2
N$108
  Top 0.305: LSP54.MP R46.2
N$109
  Top 0.305: LSP55.MP R47.2
N$110
  Top 0.305: LSP56.MP R48.2
N$111
  Top 0.305: LSP57.MP R49.2
N$112
  Top 0.305: LSP58.MP R50.2
N$116
  Top 0.305: LSP59.MP R51.2
N$120
  Top 0.305: LSP60.MP R52.2
N$121
  Top 0.305: LSP61.MP R53.2
N$122
  Top 0.305: LSP62.MP R54.2
N$123
  Top 0.305: LSP63.MP R55.2
N$124
  Top 0.305: LSP64.MP R56.2
N$125
  Top 0.305: LSP65.MP R57.2
N$126
  Top 0.305: LSP66.MP R58.2
N$127
  Top 0.305: LSP67.MP R59.2
N$128
  Top 0.305: LSP68.MP R60.2
N$129
  Top 0.305: IC2.14 83.31,67.31 90.68,74.68 93.22,74.68 96.52,77.98 96.52,90.17 IC1.9
N$130
  Top 0.305: IC6.14 109.98,67.31 117.35,74.68 119.89,74.68 123.19,77.98 123.19,90.17 IC5.9
N$131
  Top 0.305: IC7.14 109.98,41.91 118.62,50.55 119.89,50.55 123.19,53.85 123.19,66.04 IC6.9
N$132
  Top 0.305: IC3.14 83.31,41.91 91.95,50.55 93.22,50.55 94.23,51.56 94.23,58.93 93.98,59.18 93.98,66.04 IC2.9
N$133
  Top 0.305: IC4.14 83.31,17.78 90.68,25.15 93.22,25.15 94.23,26.16 94.23,33.53 93.98,33.78 93.98,40.64 IC3.9
N$134
  Top 0.305: IC8.14 109.98,17.78 117.35,25.15 119.89,25.15 120.9,26.16 120.9,33.53 120.65,33.78 120.65,40.64 IC7.9
N$135
  Top 0.305: U$1.D8 43.94,102.87 47.24,99.57 116.08,99.57 S1.3
N$136
  Top 0.305: IC4.12 96.52,26.67 96.52,42.42 95.76,43.18 | 95.76,43.18 88.9,43.18 IC3.12 | 95.76,43.18 95.76,58.42 96.52,59.18 96.52,67.82 95.76,68.58 88.9,68.58 IC2.12
  Bottom 0.305: IC4.12 88.39,17.78 89.66,16.51 109.73,16.51 110.49,17.27 110.49,18.29 111.25,19.05 113.03,19.05 IC8.12 | IC3.12 88.39,41.91 89.66,40.64 113.03,40.64 IC7.12 | IC2.12 88.39,67.31 89.66,68.58 101.35,68.58 | 101.35,68.58 113.03,68.58 IC6.12 | 101.35,89.66 112.52,89.66 IC5.12 | 101.35,89.66 90.17,89.66 88.39,91.44 IC1.12 86.36,90.17 50.04,90.17 37.34,102.87 U$1.D10 | 101.35,89.66 101.35,68.58
N$137
  Bottom 0.305: IC1.14 81.79,91.44 69.09,104.14 35.31,104.14 U$1.D11
N$138
  Top 0.305: IC8.11 115.57,16.51 92.2,16.51 90.93,17.78 IC4.11 88.9,16.51 76.96,16.51 69.85,23.62 | IC9.11 60.45,31.75 66.8,25.4 68.07,25.4 69.85,23.62 | 69.85,23.62 79.25,33.02 80.52,33.02 81.28,33.78 81.28,34.8 87.12,40.64 88.9,40.64 IC3.11
  Bottom 0.305: IC3.11 90.93,41.91 92.71,43.69 96.52,43.69 | 96.52,43.69 115.06,43.69 IC7.11 | IC2.11 90.17,66.55 96.52,60.2 | 96.52,43.69 96.52,60.2 | 96.52,60.2 97.28,60.96 109.73,60.96 116.08,67.31 IC6.11 116.84,71.63 120.9,75.69 120.9,80.52 118.11,83.31 118.11,90.17 IC5.11 115.57,92.71 113.79,92.71 113.03,91.95 113.03,90.93 112.27,90.17 92.2,90.17 90.93,91.44 IC1.11 90.17,103.12 88.14,105.16 32,105.16 29.72,102.87 U$1.D13
N$139
  Bottom 0.305: IC8.9 121.16,17.78 118.62,20.32 63.5,20.32 IC9.14
N$140
  Top 0.305: D1.A 89.15,101.6 87.63,103.12 65.02,103.12 64.01,104.14 52.07,104.14 U$1.D5
N$141
  Top 0.305: T4.B 36.32,17.02 36.32,23.62 T3.B 60.2,25.4 66.55,19.05 IC9.1
N$142  (via drill 0.51)
  Top 0.305: IC4.9 95.25,24.64 102.11,31.5 v102.11,91.19
  Bottom 0.305: v102.11,91.19 103.63,92.71 107.95,92.71 IC5.14
N$143
  Top 0.305: T6.B 24.89,17.02 24.89,23.62 T5.B 27.69,26.42 45.21,26.42 46.74,27.94 60.2,27.94 66.55,21.59 IC9.2
N$144
  Top 0.305: T8.B 24.89,24.89 24.89,25.91 25.91,26.92 44.96,26.92 48.51,30.48 60.96,30.48 IC9.3
N$145
  Top 0.305: LSP69.MP R61.2
N$146
  Top 0.305: LSP70.MP R62.2
N$147
  Top 0.305: LSP71.MP R63.2
N$148
  Top 0.305: T2.B 53.34,15.24 IC9.15
  Bottom 0.305: T1.B 54.61,26.67 IC9.15
N$149
  Top 0.305: LSP72.MP R64.2
N$150
  Top 0.305: D2.A 46.99,101.6 U$1.D7
N$151
  Top 0.305: LSP3.MP T6.C 28.45,14.48 28.45,18.29 26.67,20.07 T5.C
N$152
  Top 0.305: LSP4.MP T8.C 13.46,14.48 13.46,18.29 15.24,20.07 T7.C
N$153
  Top 0.305: LSP2.MP T4.C 39.88,14.48 39.88,18.29 38.1,20.07 T3.C
N$154
  Top 0.305: LSP1.MP T2.C 47.75,14.48 47.75,18.29 49.53,20.07 T1.C
N$155
  Top 0.305: T16.C 13.46,36.07 13.46,42.67 | T15.C 13.46,42.67 | LSP8.MP 9.14,46.99 13.46,42.67
N$156
  Bottom 0.305: 25.15,35.81 24.89,36.07 24.89,42.67 T13.C | 25.15,35.81 T14.C | LSP7.MP 12.95,36.83 13.97,35.81 25.15,35.81
N$157
  Top 0.305: T12.C 28.96,34.29 21.08,26.42 6.1,26.42 LSP6.MP
N$158
  Top 0.305: LSP5.MP 14.22,24.38 20.83,24.38 29.72,33.27 48.51,33.27 T10.C
  Bottom 0.305: T10.C 47.75,36.07 47.75,42.67 T9.C

### Text on the board
tValues: 8x8x8 LED Cube / Michael McDermott / V.1